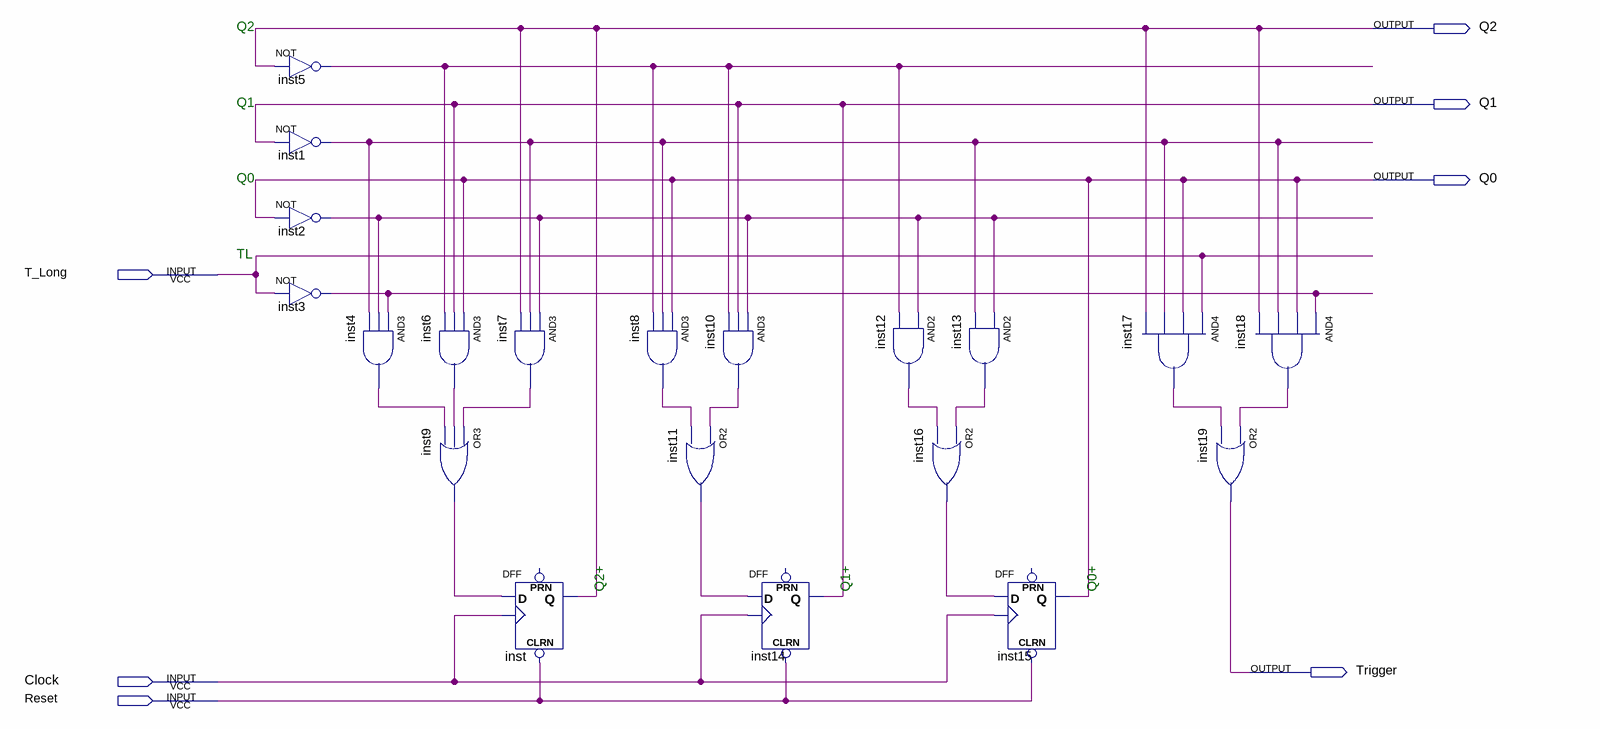
[diagram p0: schematic sheet]
// Quartus schematic Timer.bdf as structural Verilog: 20 symbols, 7 pins
module Timer (
  input  T_Long,
  input  Clock,
  input  Reset,
  output Q2,
  output Q1,
  output Q0,
  output Trigger
);

  wire inst1_out, inst2_out, inst3_out, inst4_out, inst5_out, inst6_out, inst7_out, inst8_out, inst9_out,
       inst10_out, inst11_out, inst12_out, inst13_out, inst16_out, inst17_out, inst18_out;

  not inst5 (inst5_out, Q2);
  not inst1 (inst1_out, Q1);
  not inst2 (inst2_out, Q0);
  not inst3 (inst3_out, T_Long);
  and inst4 (inst4_out, inst3_out, inst2_out, inst1_out);
  and inst6 (inst6_out, Q0, Q1, inst5_out);
  or inst9 (inst9_out, inst7_out, inst6_out, inst4_out);
  and inst7 (inst7_out, inst2_out, inst1_out, Q2);
  DFF inst (.CLRN(Reset), .CLK(Clock), .D(inst9_out), .Q(Q2));  // open: PRN
  and inst8 (inst8_out, Q0, inst1_out, inst5_out);
  and inst10 (inst10_out, inst2_out, Q1, inst5_out);
  or inst11 (inst11_out, inst10_out, inst8_out);
  DFF inst14 (.CLRN(Reset), .CLK(Clock), .D(inst11_out), .Q(Q1));  // open: PRN
  and inst12 (inst12_out, inst2_out, inst5_out);
  or inst16 (inst16_out, inst13_out, inst12_out);
  and inst13 (inst13_out, inst2_out, inst1_out);
  DFF inst15 (.CLRN(Reset), .CLK(Clock), .D(inst16_out), .Q(Q0));  // open: PRN
  and inst17 (inst17_out, T_Long, Q0, inst1_out, Q2);
  and inst18 (inst18_out, inst3_out, Q0, inst1_out, Q2);
  or inst19 (Trigger, inst18_out, inst17_out);

  // Notes on the sheet:
  //   Q2
  //   Q1
  //   Q0
  //   TL
  //   Q2+
  //   Q1+
  //   Q0+
endmodule
